# EAGLE design C=Keyv2.0 (EAGLE 4.16)
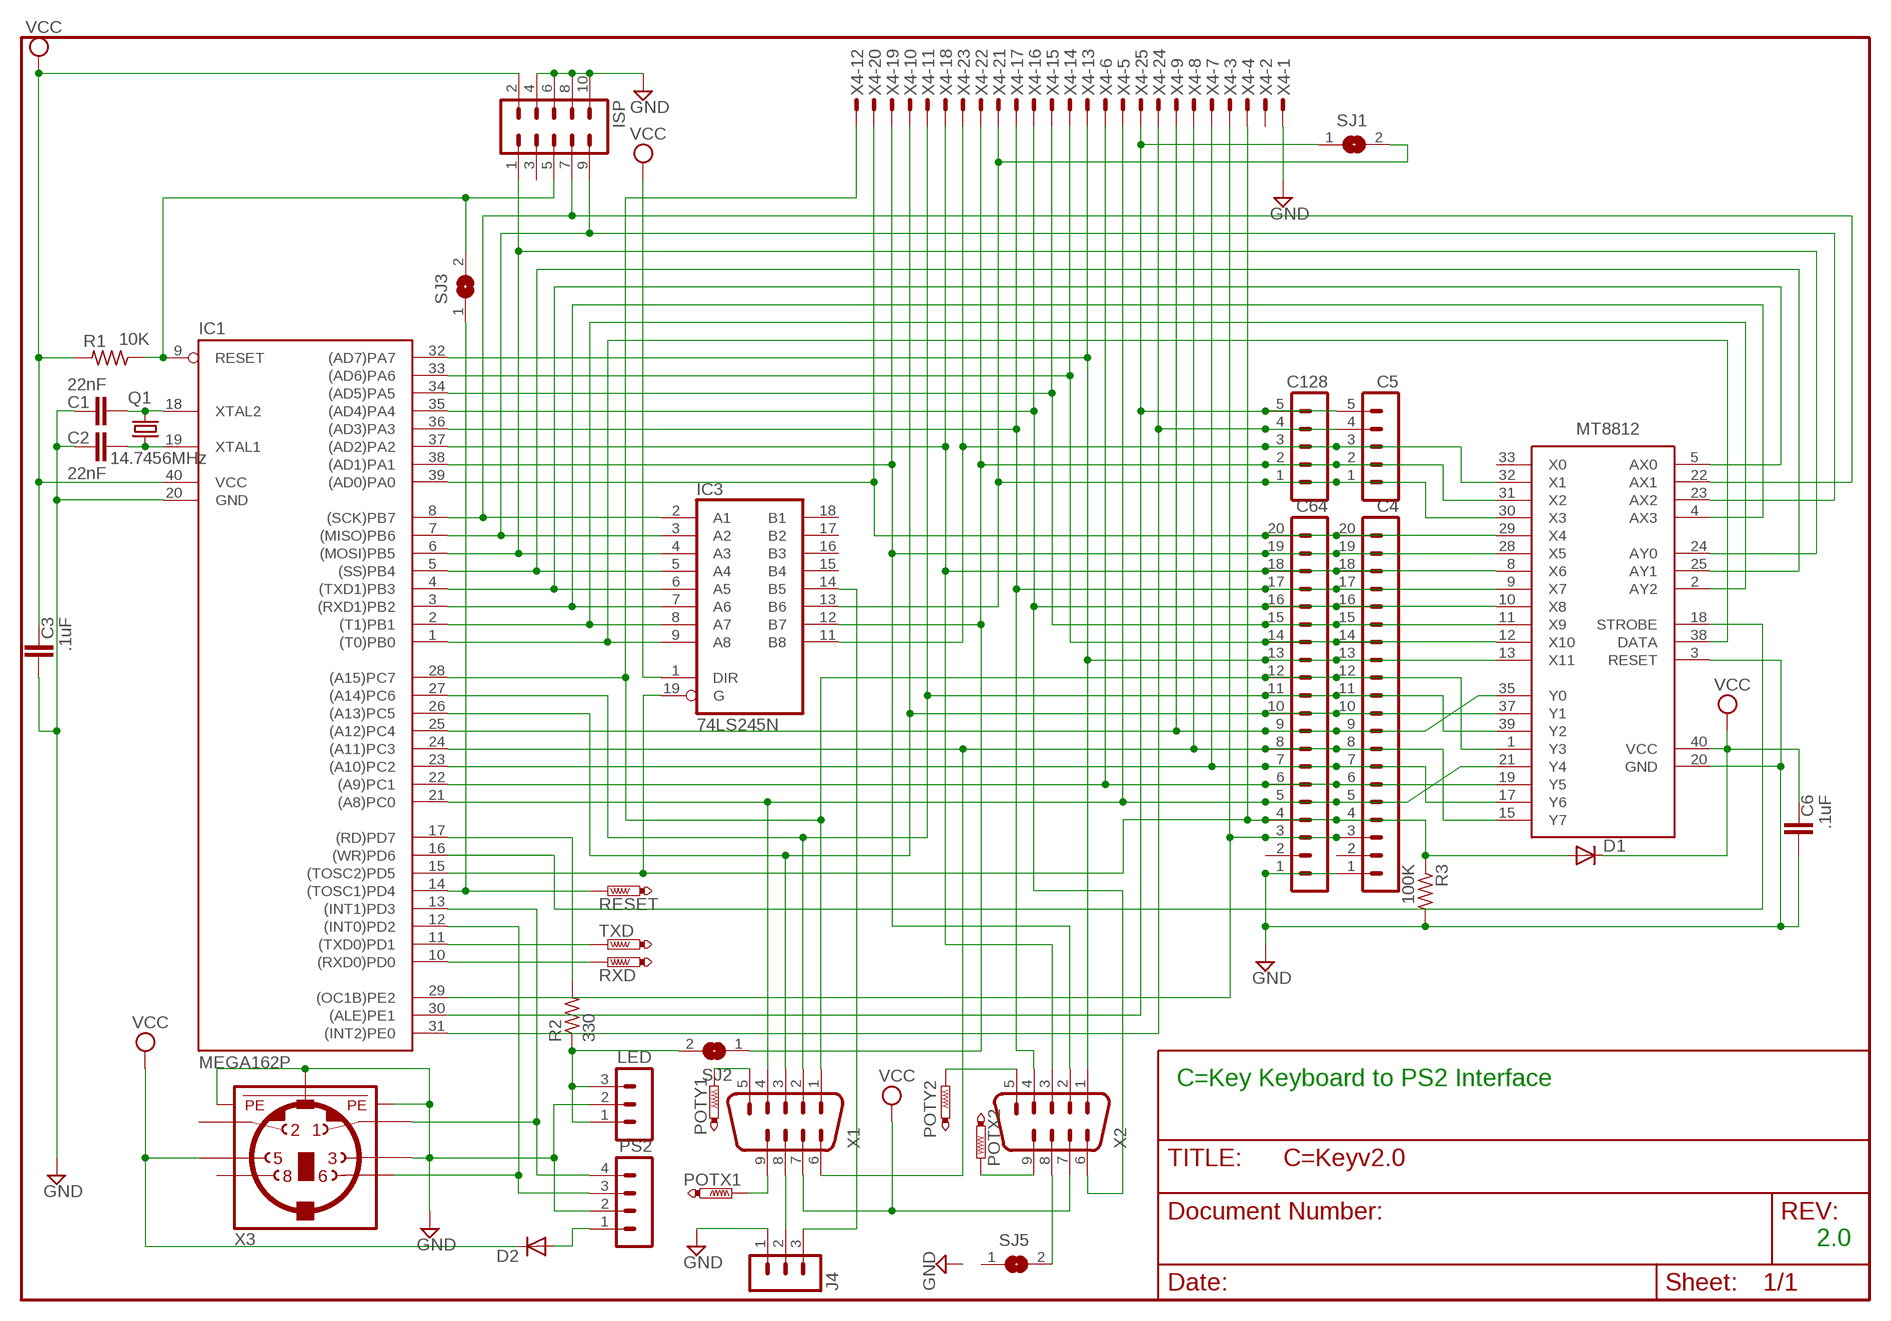
[diagram p0: schematic, sheet 1]

## Parts
C1  22nF  C2.5/2  [C2.5-2]
C2  22nF  C2.5/2  [C2.5-2]
C3  .1uF  C2.5/2  [C2.5-2]
C4  MA20-1  [MA20-1]
C5  MA05-1  [MA05-1]
C6  .1uF  C2.5/2  [C2.5-2]
C64  MA20-1  [MA20-1]
C128  MA05-1  [MA05-1]
D1  DIODE-D-5  [D-5]
D2  DIODE-D-2.5  [D-2.5]
IC1  MEGA162P  MEGA161P  [DIL40]
IC2  MT8812-P  [DIP40]
IC3  74LS245N  [DIL20]
ISP  MA05-2  [MA05-2]
J4  MA03-1  [MA03-1]
LED  MA03-1  [MA03-1]
POTX1  PTR1PAD1-13  [P1-13]
POTX2  PTR1PAD1-13  [P1-13]
POTY1  PTR1PAD1-13  [P1-13]
POTY2  PTR1PAD1-13  [P1-13]
PS2  MA04-1  [MA04-1]
Q1  14.7456MHz  CRYTALHC49U-V  [HC49U-V]
R1  10K  R-US_0204/2V  [0204V]
R2  330  R-US_0204/2V  [0204V]
R3  100K  R-US_0204/2V  [0204V]
RESET  PTR1PAD1-13  [P1-13]
RXD  PTR1PAD1-13  [P1-13]
SJ1  SJ  [SJ]
SJ2  SJ  [SJ]
SJ3  SJ  [SJ]
SJ5  SJ  [SJ]
TXD  PTR1PAD1-13  [P1-13]
X1  M09HP  [M09HP]
X2  M09HP  [M09HP]
X3  MINI_DIN_6  [M_DIN6]
X4  M25HPS  [M25HP]

## Nets
GND: C1.1 C2.1 C3.2 C4.1 C6.2 C64.1 IC1.20(GND) IC2.3(RESET) IC2.20(GND) ISP.4 ISP.6 ISP.8 ISP.10 J4.1 LED.2 PS2.2 R3.2 X3.3 X3.SH1(PE1) X3.SH2(PE2) X3.SH3(PE3) X4.1
N$1: D2.A PS2.1
N$2: C4.6 C64.6 IC1.22((A9)PC1) IC2.19(Y5) X4.6
N$3: C4.7 C64.7 IC1.23((A10)PC2) IC2.17(Y6) X4.7
N$4: C4.8 C64.8 IC1.24((A11)PC3) IC2.15(Y7) X1.6 X4.8
N$5: C4.9 C64.9 IC1.25((A12)PC4) IC2.35(Y0) X4.9
N$6: IC1.9(RESET) ISP.5 R1.1 SJ3.2
N$7: C5.1 C128.1 IC2.30(X3) IC3.13(B6) SJ1.2 X4.21
N$8: C4.5 C64.5 IC1.21((A8)PC0) IC2.21(Y4) X1.4 X4.5
N$9: C4.13 C64.13 IC1.32((AD7)PA7) IC2.13(X11) X2.1 X4.13
N$10: C4.14 C64.14 IC1.33((AD6)PA6) IC2.12(X10) X4.14
N$11: C4.15 C64.15 IC1.34((AD5)PA5) IC2.11(X9) X4.15
N$12: C4.16 C64.16 IC1.35((AD4)PA4) IC2.10(X8) X2.6 X4.16
N$13: POTX1.1(TP) X1.9
N$14: POTX2.1(TP) X2.9
N$15: C4.19 C64.19 IC1.38((AD1)PA1) IC2.28(X5) X2.2 X4.19
N$16: C4.20 C64.20 IC1.39((AD0)PA0) IC2.29(X4) X4.20
N$17: C4.4 C64.4 D1.A IC1.15((TOSC2)PD5) IC3.19(G) R3.1 X4.4
N$18: C5.3 C128.3 IC2.32(X1) IC3.11(B8) X4.23
N$19: POTY2.1(TP) X2.5
N$20: C4.10 C64.10 IC1.26((A13)PC5) IC2.37(Y1) X1.3 X4.10
N$21: IC1.16((WR)PD6) IC2.18(STROBE)
N$22: IC1.10((RXD0)PD0) RXD.1(TP)
N$23: IC1.11((TXD0)PD1) TXD.1(TP)
N$24: IC1.12((INT0)PD2) PS2.3 X3.6
N$25: IC1.13((INT1)PD3) PS2.4 X3.1
N$26: C4.3 C64.3 IC1.29((OC1B)PE2) X4.3
N$27: C5.5 C128.5 IC1.30((ALE)PE1) SJ1.1 X4.25
N$28: C5.4 C128.4 IC1.31((INT2)PE0) X4.24
N$29: IC1.14((TOSC1)PD4) RESET.1(TP) SJ3.1
N$30: IC1.17((RD)PD7) R2.2
N$31: C1.2 IC1.18(XTAL2) Q1.2
N$32: LED.1 LED.3 R2.1 SJ2.2
N$33: POTY1.1(TP) X1.5
N$34: C2.2 IC1.19(XTAL1) Q1.1
N$35: IC1.6((MOSI)PB5) IC2.24(AY0) IC3.4(A3) ISP.1
N$36: IC1.8((SCK)PB7) IC2.22(AX1) IC3.2(A1) ISP.7
N$37: IC1.7((MISO)PB6) IC2.23(AX2) IC3.3(A2) ISP.9
N$38: IC1.1((T0)PB0) IC2.38(DATA) IC3.9(A8)
N$39: IC1.2((T1)PB1) IC2.2(AY2) IC3.8(A7)
N$40: IC1.3((RXD1)PB2) IC2.4(AX3) IC3.7(A6)
N$41: IC1.4((TXD1)PB3) IC2.5(AX0) IC3.6(A5)
N$42: IC1.5((SS)PB4) IC2.25(AY1) IC3.5(A4)
N$43: IC3.14(B5) J4.3
N$44: C5.2 C128.2 IC2.31(X2) IC3.12(B7) SJ2.1 X4.22
N$45: SJ5.2 X2.8
N$46: J4.2 X1.8
N$47: C4.11 C64.11 IC1.27((A14)PC6) IC2.39(Y2) X1.2 X4.11
N$48: C4.12 C64.12 IC1.28((A15)PC7) IC2.1(Y3) X1.1 X4.12
N$51: C4.18 C64.18 IC1.37((AD2)PA2) IC2.8(X6) X2.3 X4.18
N$52: C4.17 C64.17 IC1.36((AD3)PA3) IC2.9(X7) X2.4 X4.17
VCC: C3.1 C6.1 D1.C D2.C IC1.40(VCC) IC2.40(VCC) IC3.1(DIR) ISP.2 R1.2 X1.7 X2.7 X3.5
Unconnected: C4.2 C64.2 IC2.33(X0) IC3.15(B4) IC3.16(B3) IC3.17(B2) IC3.18(B1) ISP.3 SJ5.1 X3.2 X3.8 X4.2

## Notes on the sheet
- C=Key Keyboard to PS2 Interface
- 2.0

## Power pins joined to a net without a drawn wire
GND: IC3.10(GND)
VCC: IC3.20(VCC)

## Library data of the parts
C1-C3 C6 = capacitor-wima:C: CAPACITOR naming: grid - package width
C4 C64 = con-lstb:MA20-1: PIN HEADER
C5 C128 = con-lstb:MA05-1: PIN HEADER
D1 D2 = diode:DIODE-: DIODE
IC1 = avr:MEGA161*P: MICROCONTROLLER 16 Kbytes FLASH, 512 bytes EEPROM 1 Kbytes SRAM dual UART hardware multiplier
IC2 = MT8812:MT8812-P
IC3 = 74xx-us:74*245: Octal BUS TRANSCEIVER, 3-state
ISP = con-lstb:MA05-2: PIN HEADER
J4 LED = con-lstb:MA03-1: PIN HEADER
POTX1 POTX2 POTY1 POTY2 RESET RXD TXD = testpad:PTR1: TEST PIN
PS2 = con-lstb:MA04-1: PIN HEADER
Q1 = crystal:CRYTAL: CRYSTAL
R1-R3 = rcl:R-US_: RESISTOR, American symbol
SJ1-SJ3 SJ5 = jumper:SJ: SMD solder JUMPER
X1 X2 = con-subd:M09: SUB-D
X3 = mini_din:MINI_DIN_6
X4 = con-subd:M25?S: SUB-D

## Board
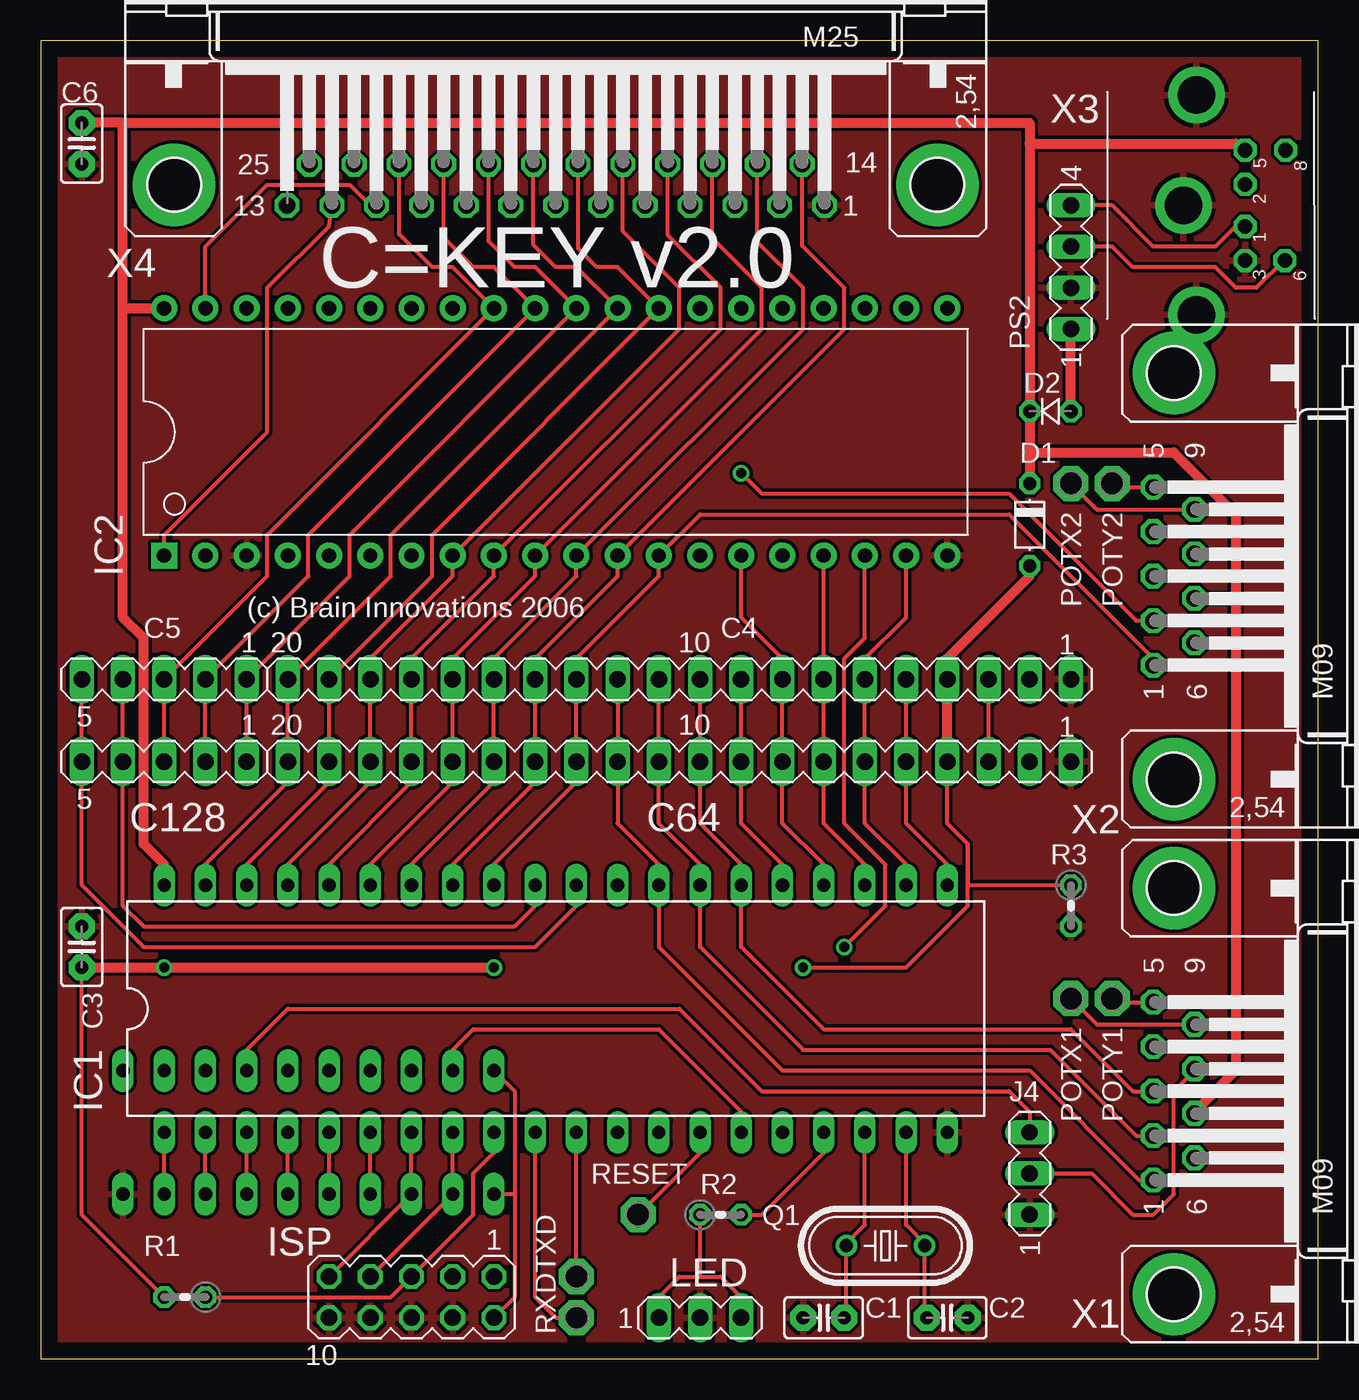
[diagram p1: board, top side]
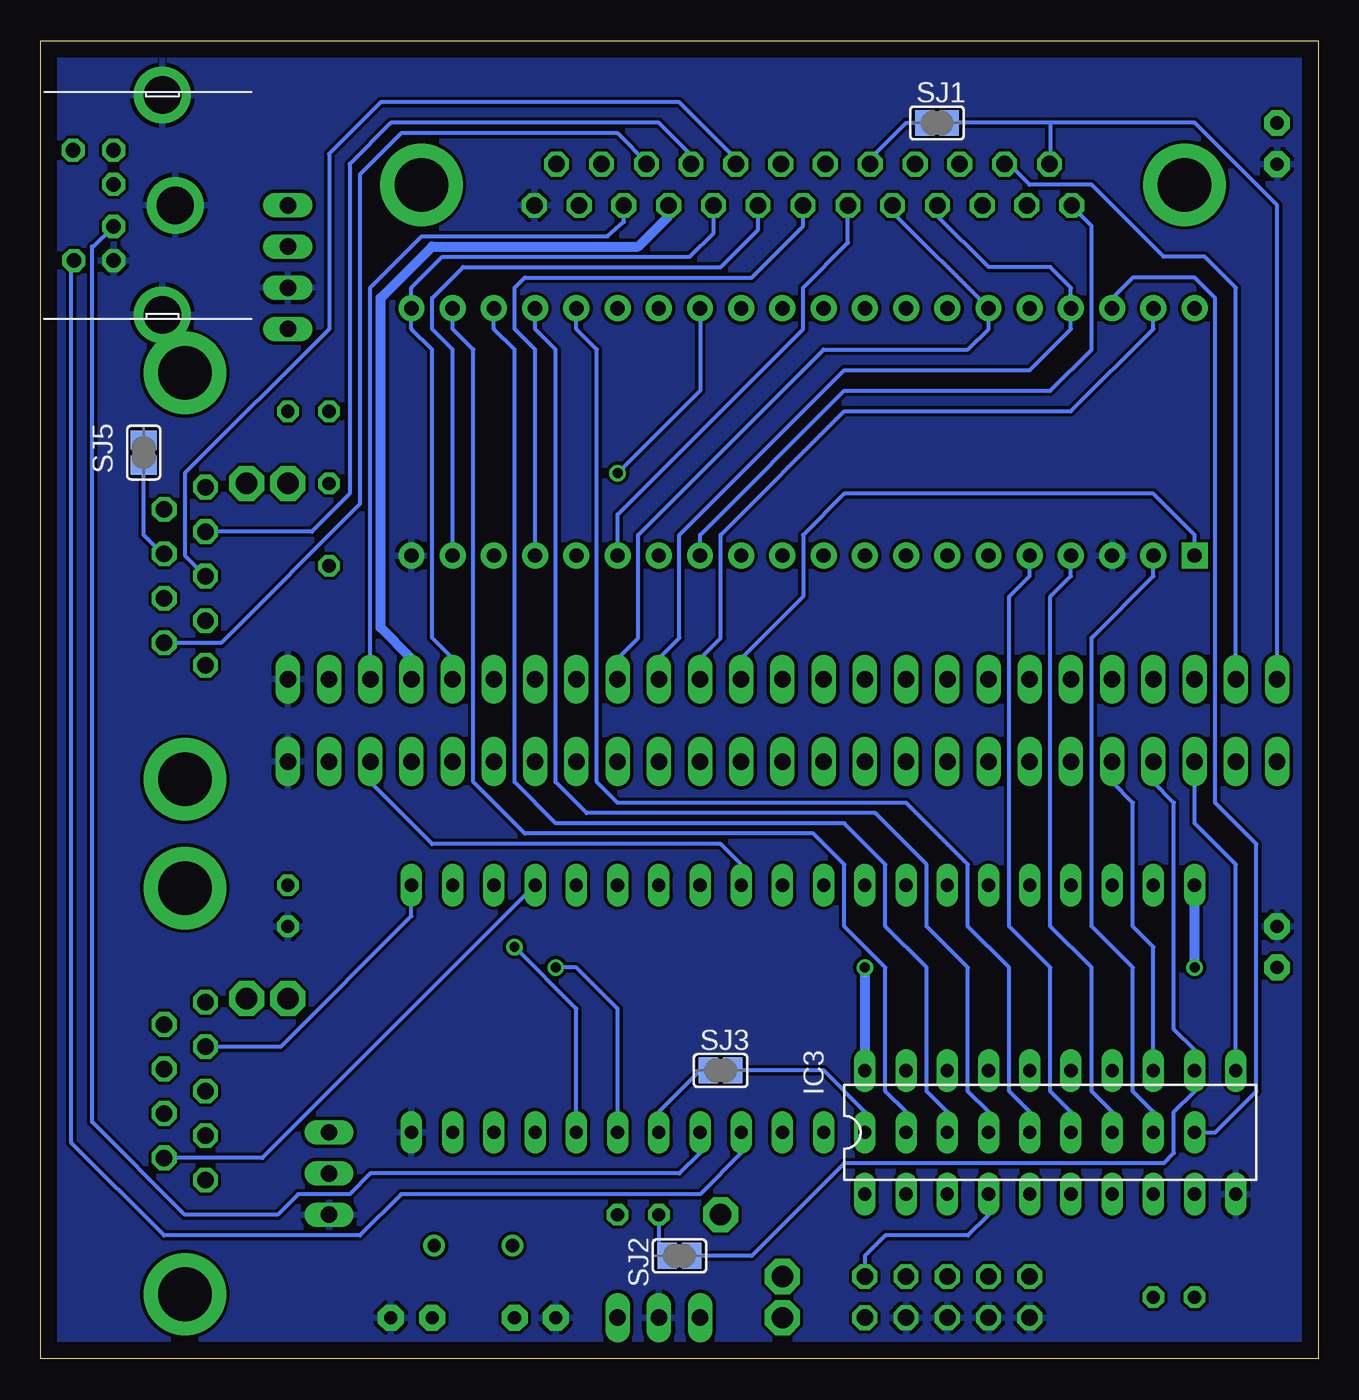
[diagram p2: board, bottom side, seen from below]

Size 78.74 x 81.28 mm. Coordinates in mm from the lower left corner, seen from the top.
Outline: 78.74,81.28 0,81.28 0,0 78.74,0 78.74,81.28
Copper layers (1*16): Top 0.035mm / dielectric 1.5mm / Bottom 0.035mm
Design rules "default": minimum track width 10mil, minimum drill 24mil, track to track 8mil, track to pad 8mil, pad to pad 8mil, via to via 8mil, smd to smd 8mil, copper to edge 40mil, drill to drill 8mil, minimum pad ring 10mil, minimum via ring 8mil, stop-mask expansion 4mil, vias tented up to drill 0mil, thermal gap 10mil

### Footprints (pad centres in the part's own frame; a part is rotated, then mirrored left to right if it is on the bottom)
C2.5-2 = drill 0.813 pad 1.6 octagon: 1 -1.27,0; 2 1.27,0
MA20-1 = drill 1.016 long: 1 -24.13,0; 2 -21.59,0; 3 -19.05,0; 4 -16.51,0; 5 -13.97,0; 6 -11.43,0; 7 -8.89,0; 8 -6.35,0; 9 -3.81,0; 10 -1.27,0; 11 1.27,0; 12 3.81,0; 13 6.35,0; 14 8.89,0; 15 11.43,0; 16 13.97,0; 17 16.51,0; 18 19.05,0; 19 21.59,0; 20 24.13,0
MA05-1 = drill 1.016 long: 1 -5.08,0; 2 -2.54,0; 3 0,0; 4 2.54,0; 5 5.08,0
D-5 = drill 0.813 octagon: A 2.54,0; C -2.54,0
D-2.5 = drill 0.813 octagon: A 1.27,0; C -1.27,0
DIL40 = drill 0.813 long: 1 -24.13,-7.62; 2 -21.59,-7.62; 3 -19.05,-7.62; 4 -16.51,-7.62; 5 -13.97,-7.62; 6 -11.43,-7.62; 7 -8.89,-7.62; 8 -6.35,-7.62; 9 -3.81,-7.62; 10 -1.27,-7.62; 11 1.27,-7.62; 12 3.81,-7.62; 13 6.35,-7.62; 14 8.89,-7.62; 15 11.43,-7.62; 16 13.97,-7.62; 17 16.51,-7.62; 18 19.05,-7.62; 19 21.59,-7.62; 20 24.13,-7.62; 21 24.13,7.62; 22 21.59,7.62; 23 19.05,7.62; 24 16.51,7.62; 25 13.97,7.62; 26 11.43,7.62; 27 8.89,7.62; 28 6.35,7.62; 29 3.81,7.62; 30 1.27,7.62; 31 -1.27,7.62; 32 -3.81,7.62; 33 -6.35,7.62; 34 -8.89,7.62; 35 -11.43,7.62; 36 -13.97,7.62; 37 -16.51,7.62; 38 -19.05,7.62; 39 -21.59,7.62; 40 -24.13,7.62
DIP40 = drill 0.889 pad 1.6 square: 1 -22.86,-7.62 | drill 0.889 pad 1.6 round: 2 -20.32,-7.62; 3 -17.78,-7.62; 4 -15.24,-7.62; 5 -12.7,-7.62; 6 -10.16,-7.62; 7 -7.62,-7.62; 8 -5.08,-7.62; 9 -2.54,-7.62; 10 0,-7.62; 11 2.54,-7.62; 12 5.08,-7.62; 13 7.62,-7.62; 14 10.16,-7.62; 15 12.7,-7.62; 16 15.24,-7.62; 17 17.78,-7.62; 18 20.32,-7.62; 19 22.86,-7.62; 20 25.4,-7.62; 21 25.4,7.62; 22 22.86,7.62; 23 20.32,7.62; 24 17.78,7.62; 25 15.24,7.62; 26 12.7,7.62; 27 10.16,7.62; 28 7.62,7.62; 29 5.08,7.62; 30 2.54,7.62; 31 0,7.62; 32 -2.54,7.62; 33 -5.08,7.62; 34 -7.62,7.62; 35 -10.16,7.62; 36 -12.7,7.62; 37 -15.24,7.62; 38 -17.78,7.62; 39 -20.32,7.62; 40 -22.86,7.62
DIL20 = drill 0.813 long: 1 -11.43,-3.81; 2 -8.89,-3.81; 3 -6.35,-3.81; 4 -3.81,-3.81; 5 -1.27,-3.81; 6 1.27,-3.81; 7 3.81,-3.81; 8 6.35,-3.81; 9 8.89,-3.81; 10 11.43,-3.81; 11 11.43,3.81; 12 8.89,3.81; 13 6.35,3.81; 14 3.81,3.81; 15 1.27,3.81; 16 -1.27,3.81; 17 -3.81,3.81; 18 -6.35,3.81; 19 -8.89,3.81; 20 -11.43,3.81
MA05-2 = drill 1.016 octagon: 1 -5.08,-1.27; 2 -5.08,1.27; 3 -2.54,-1.27; 4 -2.54,1.27; 5 0,-1.27; 6 0,1.27; 7 2.54,-1.27; 8 2.54,1.27; 9 5.08,-1.27; 10 5.08,1.27
MA03-1 = drill 1.016 long: 1 -2.54,0; 2 0,0; 3 2.54,0
P1-13 = drill 1.321 pad 2.159 octagon: 1 0,0
MA04-1 = drill 1.016 long: 1 -3.81,0; 2 -1.27,0; 3 1.27,0; 4 3.81,0
HC49U-V = drill 0.813 round: 1 -2.413,0; 2 2.413,0
0204V = drill 0.813 octagon: 1 -1.27,0; 2 1.27,0
SJ = smd 1.168 x 1.6: 1 -0.762,0; 2 0.762,0
M09HP = drill 1.016 octagon: 1 -5.486,1.27; 2 -2.743,1.27; 3 0,1.27; 4 2.743,1.27; 5 5.486,1.27; 6 -4.115,-1.27; 7 -1.372,-1.27; 8 1.372,-1.27; 9 4.115,-1.27 | drill 3.302 pad 5.08 round: G1 -12.522,0; G2 12.522,0
M_DIN6 = drill 0.9 pad 1.422 octagon: 1 -1.3,-3.75; 2 1.3,-3.75; 3 -3.4,-3.75; 5 3.4,-3.75; 6 -3.4,-6.2; 8 3.4,-6.25 | drill 2.3 pad 3.5 round: SH1 6.8,-0.75; SH2 0,0.05; SH3 -6.75,-0.75
M25HP = drill 1.016 octagon: 1 -16.561,1.27; 2 -13.792,1.27; 3 -11.049,1.27; 4 -8.28,1.27; 5 -5.512,1.27; 6 -2.769,1.27; 7 0,1.27; 8 2.769,1.27; 9 5.512,1.27; 10 8.28,1.27; 11 11.049,1.27; 12 13.792,1.27; 13 16.561,1.27; 14 -15.189,-1.27; 15 -12.421,-1.27; 16 -9.652,-1.27; 17 -6.909,-1.27; 18 -4.14,-1.27; 19 -1.372,-1.27; 20 1.372,-1.27; 21 4.14,-1.27; 22 6.909,-1.27; 23 9.652,-1.27; 24 12.421,-1.27; 25 15.189,-1.27 | drill 3.302 pad 5.08 round: G1 -23.52,0; G2 23.52,0

### Placement (x,y rotation side)
C1  48.26,2.54 0 top
C2  55.88,2.54 180 top
C3  2.54,25.4 90 top
C4  39.37,41.91 180 top
C5  7.62,41.91 180 top
C6  2.54,74.93 270 top
C64  39.37,36.83 180 top
C128  7.62,36.83 180 top
D1  60.96,51.44 270 top
D2  62.23,58.42 0 top
IC1  31.75,21.59 0 top
IC2  30.48,57.15 0 top
IC3  16.51,13.97 0 bottom
ISP  22.86,3.81 180 top
J4  60.96,11.43 90 top
LED  40.64,2.54 0 top
POTX1  63.5,22.23 0 top
POTX2  63.5,53.98 0 top
POTY1  66.04,22.23 0 top
POTY2  66.04,53.98 0 top
PS2  63.5,67.31 90 top
Q1  52.07,6.99 180 top
R1  8.89,3.81 180 top
R2  41.91,8.89 0 top
R3  63.5,27.94 270 top
RESET  36.83,8.89 0 top
RXD  33.02,2.54 0 top
SJ1  23.5,76.2 180 bottom
SJ2  39.37,6.35 180 bottom
SJ3  36.83,17.78 0 bottom
SJ5  72.39,55.88 270 bottom
TXD  33.02,5.08 0 top
X1  69.85,16.51 90 top
X2  69.85,48.26 90 top
X3  70.48,71.12 90 top
X4  31.75,72.39 180 top

### Tracks (layer width: path | path; a pad name or v marks a point on that pad's centre or on a via)
GND
  pour Top: 78.74,0 0,0 0,81.28 78.74,81.28
  pour Bottom: 78.74,0 0,0 0,81.28 78.74,81.28
N$1
  Top 0.61: D2.A PS2.1
N$2
  Top 0.254: IC2.19 53.34,45.72 50.8,43.18 C4.6 C64.6 50.8,33.02 53.34,30.48 IC1.22
  Bottom 0.254: X4.6 34.52,69.62 36.83,67.31 52.7,67.31 54.61,65.41 54.61,63.5 53.34,62.23 IC2.19
N$3
  Top 0.254: IC2.17 C4.7 C64.7 48.26,33.02 50.8,30.48 IC1.23
  Bottom 0.254: X4.7 31.75,69.85 34.92,66.67 48.9,66.67 49.53,66.04 49.53,63.5 48.26,62.23 IC2.17
N$4
  Top 0.254: IC2.15 43.18,45.72 45.72,43.18 C4.8 C64.8 45.72,33.02 48.26,30.48 IC1.24
  Bottom 0.254: X4.8 28.98,68.81 31.75,66.04 31.75,63.5 43.18,52.07 IC2.15 | X1.6 65.08,12.39 IC1.24
N$5
  Top 0.254: C4.9 C64.9 43.18,33.02 45.72,30.48 IC1.25
  Bottom 0.254: C4.9 43.18,43.18 41.91,44.45 41.91,50.8 30.48,62.23 21.59,62.23 20.32,63.5 IC2.35 26.24,70.69 X4.9
N$6
  Top 0.254: IC1.9 27.94,12.7 26.67,11.43 26.67,8.89 ISP.5 21.59,3.81 R1.1
  Bottom 0.254: SJ3.2 30.48,17.78 27.94,15.24 IC1.9
N$7
  Top 0.254: C128.1 C5.1 19.05,48.26 19.05,50.8 IC2.30 30.48,67.31 29.21,67.31 27.61,68.91 X4.21
  Bottom 0.254: IC3.13 10.16,25.4 11.43,26.67 11.43,34.29 12.7,35.56 C128.1 | SJ1.2 25.4,76.2 27.61,73.99 X4.21
N$8
  Top 0.254: C4.5 C64.5 53.34,33.02 55.88,30.48 IC1.21
  Bottom 0.254: C4.5 53.34,43.18 54.61,44.45 54.61,62.23 55.88,63.5 IC2.21 55.88,66.04 53.98,67.94 38.73,67.94 37.26,69.42 X4.5 | X1.4 63.93,19.25 55.88,27.3 IC1.21
N$9
  Top 0.254: IC1.32 27.94,30.48 33.02,35.56 C64.13 C4.13 33.02,43.18 38.1,48.26 IC2.13 40.64,52.07 59.69,52.07 68.58,43.18 X2.1
  Bottom 0.254: IC2.13 38.1,50.8 29.21,59.69 16.51,59.69 13.97,62.23 13.97,69.85 15.19,71.07 X4.13
N$10
  Top 0.254: IC1.33 25.4,30.48 30.48,35.56 C64.14 C4.14 30.48,43.18 35.56,48.26 IC2.12 49.53,63.5 49.53,66.04 46.94,68.63 X4.14
N$11
  Top 0.254: IC1.34 22.86,30.48 27.94,35.56 C64.15 C4.15 27.94,43.18 33.02,48.26 IC2.11 46.99,63.5 46.99,66.04 44.17,68.86 X4.15
N$12
  Top 0.254: IC1.35 20.32,30.48 25.4,35.56 C64.16 C4.16 25.4,43.18 30.48,48.26 IC2.10 44.45,63.5 44.45,66.04 41.4,69.09 X4.16
  Bottom 0.254: X4.16 41.27,73.66 43.18,75.56 56.52,75.56 59.05,73.03 59.05,52.7 67.61,44.15 X2.6
N$13
  Top 0.254: X1.9 65.1,20.62 POTX1.1
N$14
  Top 0.254: X2.9 65.1,52.38 POTX2.1
N$15  (via drill 0.61)
  Top 0.254: IC1.38 12.7,30.48 17.78,35.56 C64.19 C4.19 24.13,48.26 24.13,50.8 IC2.28 35.56,67.31 34.29,67.31 33.12,68.48 X4.19 | X2.2 67.51,45.52 59.69,53.34 44.45,53.34 v43.18,54.61
  Bottom 0.254: IC2.28 38.1,59.69 v43.18,54.61
N$16
  Top 0.254: IC1.39 10.16,30.48 15.24,35.56 C64.20 C4.20 21.59,48.26 21.59,50.8 IC2.29 33.02,67.31 31.75,67.31 30.38,68.68 X4.20
N$17  (via drill 0.61)
  Top 0.254: IC3.19 25.4,19.05 26.67,20.32 38.1,20.32 43.18,15.24 IC1.15 | C64.4 55.88,33.02 57.15,31.75 | 57.15,31.75 57.15,27.94 53.34,24.13 v46.99,24.13 | 57.15,31.75 57.15,29.21 R3.1
  Top 0.61: C64.4 C4.4 55.88,43.18 60.96,48.26 D1.A
  Bottom 0.254: v46.99,24.13 45.72,24.13 43.18,21.59 IC1.15
  Bottom 0.61: X4.4 40.03,70.46 41.91,68.58 54.61,68.58 57.78,65.41 57.78,45.09 55.88,43.18 C4.4
N$18
  Top 0.254: C128.3 C5.3 13.97,48.26 13.97,50.8 IC2.32 25.4,67.31 24.13,67.31 22.1,69.34 X4.23
  Bottom 0.254: IC3.11 5.08,30.48 7.62,33.02 C128.3
N$19
  Top 0.254: X2.5 66.04,53.75 POTY2.1
N$20
  Top 0.254: C4.10 C64.10 40.64,33.02 43.18,30.48 IC1.26 43.18,25.4 48.26,20.32 63.5,20.32 67.31,16.51 X1.3
  Bottom 0.254: C4.10 40.64,43.18 39.37,44.45 39.37,50.8 29.21,60.96 17.78,60.96 15.24,63.5 IC2.37 15.24,66.04 16.51,67.31 20.32,67.31 23.5,70.48 X4.10
N$21  (via drill 0.61)
  Top 0.254: IC2.18 50.8,44.45 49.53,43.18 49.53,33.02 52.07,30.48 52.07,27.94 v49.53,25.4
  Bottom 0.254: v49.53,25.4 45.72,21.59 IC1.16
N$22
  Top 0.254: IC1.10 30.48,3.81 31.75,2.54 RXD.1
N$23
  Top 0.254: TXD.1 IC1.11
N$24
  Top 0.254: X3.6 76.61,67.72 74.93,66.04 73.66,66.04 72.39,67.31 67.31,67.31 66.04,68.58 PS2.3
  Bottom 0.254: IC1.12 35.56,12.7 38.1,10.16 56.52,10.16 59.05,7.62 71.12,7.62 76.83,13.34 76.83,67.31 76.69,67.46 X3.6
N$25
  Top 0.254: X3.1 73.63,69.82 72.39,68.58 68.58,68.58 66.04,71.12 PS2.4
  Bottom 0.254: IC1.13 38.1,12.7 39.37,11.43 58.42,11.43 59.69,10.16 62.87,10.16 64.14,8.89 69.85,8.89 75.56,14.61 75.56,68.58 75.53,68.55 X3.1
N$26
  Top 0.254: C64.3 C4.3
  Bottom 0.254: IC1.29 35.56,30.48 36.83,31.75 54.61,31.75 58.42,35.56 C64.3 | X4.3 42.8,70.1 43.81,69.22 55.24,69.22 58.42,66.04 C4.3
N$27
  Top 0.254: C5.5 C128.5 2.54,29.21 6.35,25.4 30.48,25.4 33.02,27.94 IC1.30
  Bottom 0.254: 16.51,76.2 7.62,76.2 2.54,71.12 C5.5 | X4.25 16.51,73.66 16.51,76.2 | 16.51,76.2 SJ1.1
N$28
  Top 0.254: C5.4 C128.4 5.08,27.94 6.35,26.67 29.21,26.67 30.48,27.94 IC1.31
  Bottom 0.254: C5.4 5.08,66.04 6.99,67.94 9.53,67.94 13.97,72.39 17.78,72.39 19.05,73.66 X4.24
N$29
  Top 0.254: IC1.14 40.64,12.7 RESET.1
  Bottom 0.254: SJ3.1 38.1,17.78 40.64,15.24 IC1.14
N$30
  Top 0.254: IC1.17 48.26,12.7 44.45,8.89 R2.2
N$31
  Top 0.254: IC1.18 50.8,8.26 49.53,6.99 Q1.2 49.66,2.67 C1.2
N$32
  Top 0.254: LED.1 38.1,3.81 39.37,5.08 40.64,5.08 | 40.64,5.08 R2.1 | LED.3 43.18,3.81 41.91,5.08 40.64,5.08
  Bottom 0.254: SJ2.2 40.64,6.35 R2.1
N$33
  Top 0.254: X1.5 66.04,22 POTY1.1
N$34
  Top 0.254: IC1.19 53.34,8.26 54.61,6.99 Q1.1 54.48,2.67 C2.2
N$35
  Top 0.254: IC3.4 IC1.6
  Bottom 0.254: IC2.24 48.26,63.5 46.99,62.23 46.99,35.56 45.09,33.66 27.3,33.66 24.13,30.48 24.13,26.67 21.59,24.13 21.59,16.51 20.32,15.24 IC1.6 | IC3.4 20.32,8.89 21.59,7.62 26.67,7.62 27.94,6.35 ISP.1
N$36
  Top 0.254: IC3.2 IC1.8 IC3.2 | ISP.7 IC3.2
  Bottom 0.254: IC2.22 53.34,63.5 52.07,62.23 52.07,35.56 48.9,32.38 31.11,32.38 29.21,30.48 29.21,26.67 26.67,24.13 26.67,16.51 25.4,15.24 IC1.8
N$37
  Top 0.254: IC3.3 IC1.7 IC3.3 | ISP.9 IC3.3
  Bottom 0.254: IC2.23 50.8,63.5 49.53,62.23 49.53,35.56 46.99,33.02 29.21,33.02 26.67,30.48 26.67,26.67 24.13,24.13 24.13,16.51 22.86,15.24 IC1.7
N$38
  Top 0.254: IC3.9 IC1.1
  Bottom 0.254: IC2.38 12.7,65.41 11.43,66.67 7.62,66.67 6.35,65.41 6.35,34.29 3.81,31.75 3.81,16.51 6.35,13.97 IC1.1
N$39
  Top 0.254: IC3.8 IC1.2
  Bottom 0.254: IC2.2 10.16,48.26 13.97,44.45 13.97,26.67 11.43,24.13 11.43,16.51 10.16,15.24 IC1.2
N$40
  Top 0.254: IC3.7 IC1.3
  Bottom 0.254: IC2.4 15.24,48.26 16.51,46.99 16.51,26.67 13.97,24.13 13.97,16.51 12.7,15.24 IC1.3
N$41
  Top 0.254: IC3.6 IC1.4
  Bottom 0.254: IC2.5 17.78,48.26 19.05,46.99 19.05,26.67 16.51,24.13 16.51,16.51 15.24,15.24 IC1.4
N$42
  Top 0.254: IC3.5 IC1.5
  Bottom 0.254: IC2.25 45.72,63.5 44.45,62.23 44.45,35.56 43.18,34.29 25.4,34.29 21.59,30.48 21.59,26.67 19.05,24.13 19.05,16.51 17.78,15.24 IC1.5
N$43
  Top 0.254: IC3.14 12.7,19.05 15.24,21.59 39.37,21.59 44.45,16.51 59.69,16.51 60.96,15.24 J4.3
N$44
  Top 0.254: C128.2 C5.2 16.51,48.26 16.51,50.8 IC2.31 27.94,67.31 26.67,67.31 24.84,69.14 X4.22
  Bottom 0.254: C128.2 10.16,35.56 8.89,34.29 8.89,20.32 7.62,19.05 IC3.12 7.62,16.51 8.89,15.24 8.89,12.7 9.53,12.06 29.21,12.06 34.92,6.35 SJ2.1
N$45
  Bottom 0.254: X2.8 71.12,49.53 72.39,50.8 SJ5.2
N$46
  Top 0.254: X1.8 71.12,17.78 69.85,16.51 69.85,10.16 68.58,8.89 67.31,8.89 64.77,11.43 J4.2
N$47
  Top 0.254: C4.11 C64.11 38.1,33.02 40.64,30.48 IC1.27 40.64,25.4 46.99,19.05 62.23,19.05 67.51,13.77 X1.2 | IC2.39 10.16,68.58 13.97,72.39 19.05,72.39 20.32,71.12 X4.11
  Bottom 0.254: C4.11 38.1,43.18 36.83,44.45 36.83,50.8 29.21,58.42 15.24,58.42 10.16,63.5 IC2.39
N$48
  Top 0.254: C4.12 C64.12 35.56,33.02 38.1,30.48 IC1.28 38.1,25.4 45.72,17.78 60.96,17.78 67.72,11.02 X1.1 | X4.12 17.78,69.85 13.97,66.04 13.97,57.15 7.62,50.8 IC2.1
  Bottom 0.254: C4.12 35.56,43.18 31.75,46.99 31.75,50.8 29.21,53.34 10.16,53.34 7.62,50.8 IC2.1
N$51
  Top 0.254: IC1.37 15.24,30.48 20.32,35.56 C64.18 C4.18 20.32,43.18 25.4,48.26 IC2.8 39.37,63.5 39.37,66.04 35.89,69.52 X4.18
  Bottom 0.254: X2.3 69.85,49.53 69.85,54.61 60.96,63.5 60.96,74.3 57.78,77.47 39.37,77.47 35.89,73.99 X4.18
N$52
  Top 0.254: IC1.36 17.78,30.48 22.86,35.56 C64.17 C4.17 22.86,43.18 27.94,48.26 IC2.9 41.91,63.5 41.91,66.04 38.66,69.29 X4.17
  Bottom 0.254: X4.17 38.73,73.66 38.73,74.3 40.64,76.2 57.15,76.2 59.69,73.66 59.69,53.34 62.03,51 X2.4
VCC  (via drill 0.61)
  Top 0.254: R1.2 2.54,8.89 C3.1 | ISP.2 29.21,3.81 29.21,10.16 | 29.21,10.16 29.21,16.51 IC3.20 | 29.21,10.16 IC3.1 | 71.12,15.24 X1.7 | 73.66,46.99 73.56,46.89
  Top 0.61: IC1.40 7.62,30.48 6.35,31.75 6.35,44.45 5.08,45.72 5.08,64.77 | v27.94,24.13 v7.62,24.13 C3.1 | 5.08,64.77 IC2.40 | 5.08,64.77 5.08,76.2 | 5.08,76.2 C6.1 | 5.08,76.2 60.96,76.2 60.96,74.93 | 71.12,15.24 73.66,17.78 73.66,46.99 73.66,52.07 69.85,55.88 60.96,55.88 | 73.56,46.89 X2.7 | 60.96,74.93 D2.C 60.96,55.88 | 60.96,55.88 D1.C | 60.96,74.93 73.66,74.93 X3.5
  Bottom 0.61: v7.62,24.13 IC1.40 | v27.94,24.13 IC3.20

### Text on the board
tPlace: C=KEY v2.0 | (c) Brain Innovations 2006